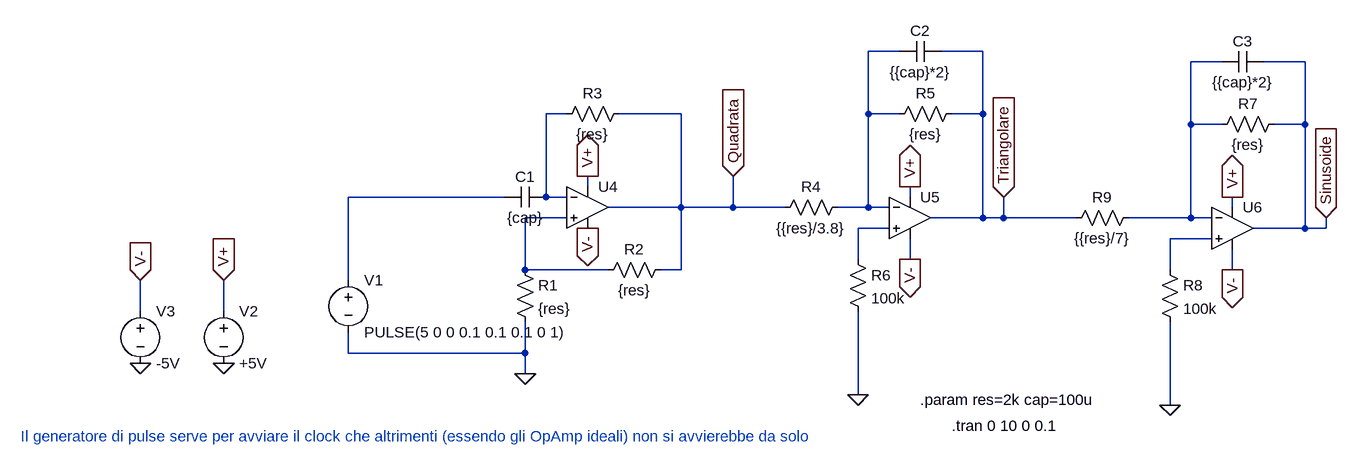
[diagram p0: schematic progetto_PSE_v_Stabile.asc]
progetto_PSE_v_Stabile.asc, the LTspice schematic file:
Version 4
SHEET 1 1248 680
WIRE 416 -144 368 -144
WIRE 544 -144 480 -144
WIRE 912 -128 864 -128
WIRE 1040 -128 976 -128
WIRE -96 -48 -128 -48
WIRE 80 -48 -16 -48
WIRE 368 -48 368 -144
WIRE 416 -48 368 -48
WIRE 544 -48 544 -144
WIRE 544 -48 496 -48
WIRE 864 -32 864 -128
WIRE 912 -32 864 -32
WIRE 1040 -32 1040 -128
WIRE 1040 -32 992 -32
WIRE -64 64 -64 48
WIRE -192 80 -432 80
WIRE -128 80 -128 -48
WIRE -96 80 -128 80
WIRE 432 80 432 64
WIRE 80 96 80 -48
WIRE 80 96 -32 96
WIRE 160 96 160 48
WIRE 160 96 80 96
WIRE 240 96 160 96
WIRE 368 96 368 -48
WIRE 368 96 320 96
WIRE 400 96 368 96
WIRE 928 96 928 80
WIRE -96 112 -160 112
WIRE 544 112 544 -48
WIRE 544 112 464 112
WIRE 576 112 576 80
WIRE 576 112 544 112
WIRE 688 112 576 112
WIRE 864 112 864 -32
WIRE 864 112 768 112
WIRE 896 112 864 112
WIRE 400 128 352 128
WIRE 1040 128 1040 -32
WIRE 1040 128 960 128
WIRE 1072 128 1072 112
WIRE 1072 128 1040 128
WIRE 896 144 832 144
WIRE 352 176 352 128
WIRE 432 176 432 144
WIRE -160 192 -160 112
WIRE -32 192 -160 192
WIRE 80 192 80 96
WIRE 80 192 48 192
WIRE 832 192 832 144
WIRE 928 192 928 160
WIRE -432 208 -432 80
WIRE -752 256 -752 208
WIRE -624 256 -624 208
WIRE -432 320 -432 288
WIRE -160 320 -160 272
WIRE -160 320 -432 320
WIRE -160 352 -160 320
WIRE 352 384 352 256
WIRE 832 400 832 272
FLAG -160 352 0
FLAG 352 384 0
FLAG 432 64 V+
IOPIN 432 64 Out
FLAG -64 48 V+
IOPIN -64 48 Out
FLAG -64 128 V-
IOPIN -64 128 Out
FLAG 432 176 V-
IOPIN 432 176 Out
FLAG 576 80 Triangolare
IOPIN 576 80 In
FLAG 160 48 Quadrata
IOPIN 160 48 In
FLAG 832 400 0
FLAG 928 80 V+
IOPIN 928 80 Out
FLAG 928 192 V-
IOPIN 928 192 Out
FLAG 1072 112 Sinusoide
IOPIN 1072 112 In
FLAG -624 336 0
FLAG -624 208 V+
IOPIN -624 208 In
FLAG -752 336 0
FLAG -752 208 V-
IOPIN -752 208 In
SYMBOL cap -128 64 R90
WINDOW 0 0 32 VBottom 2
WINDOW 3 32 32 VTop 2
SYMATTR InstName C1
SYMATTR Value {cap}
SYMBOL res -176 176 R0
SYMATTR InstName R1
SYMATTR Value {res}
SYMBOL res 64 176 R90
WINDOW 0 0 56 VBottom 2
WINDOW 3 32 56 VTop 2
SYMATTR InstName R2
SYMATTR Value {res}
SYMBOL res 0 -64 R90
WINDOW 0 0 56 VBottom 2
WINDOW 3 32 56 VTop 2
SYMATTR InstName R3
SYMATTR Value {res}
SYMBOL res 336 80 R90
WINDOW 0 0 56 VBottom 2
WINDOW 3 32 56 VTop 2
SYMATTR InstName R4
SYMATTR Value {{res}/3.8}
SYMBOL res 512 -64 R90
WINDOW 0 0 56 VBottom 2
WINDOW 3 32 56 VTop 2
SYMATTR InstName R5
SYMATTR Value {res}
SYMBOL cap 480 -160 R90
WINDOW 0 0 32 VBottom 2
WINDOW 3 32 32 VTop 2
SYMATTR InstName C2
SYMATTR Value {{cap}*2}
SYMBOL res 336 160 R0
SYMATTR InstName R6
SYMATTR Value 100k
SYMBOL res 1008 -48 R90
WINDOW 0 0 56 VBottom 2
WINDOW 3 32 56 VTop 2
SYMATTR InstName R7
SYMATTR Value {res}
SYMBOL cap 976 -144 R90
WINDOW 0 0 32 VBottom 2
WINDOW 3 32 32 VTop 2
SYMATTR InstName C3
SYMATTR Value {{cap}*2}
SYMBOL res 816 176 R0
SYMATTR InstName R8
SYMATTR Value 100k
SYMBOL res 784 96 R90
WINDOW 0 0 56 VBottom 2
WINDOW 3 32 56 VTop 2
SYMATTR InstName R9
SYMATTR Value {{res}/7}
SYMBOL voltage -432 192 R0
WINDOW 123 0 0 Left 0
WINDOW 39 0 0 Left 0
SYMATTR InstName V1
SYMATTR Value PULSE(5 0 0 0.1 0.1 0.1 0 1)
SYMBOL Opamps\\UniversalOpamp2 -64 96 R0
SYMATTR InstName U4
SYMBOL Opamps\\UniversalOpamp2 432 112 R0
SYMATTR InstName U5
SYMBOL Opamps\\UniversalOpamp2 928 128 R0
SYMATTR InstName U6
SYMBOL voltage -624 240 R0
WINDOW 123 0 0 Left 0
WINDOW 39 0 0 Left 0
SYMATTR InstName V2
SYMATTR Value +5V
SYMBOL voltage -752 240 R0
WINDOW 123 0 0 Left 0
WINDOW 39 0 0 Left 0
SYMATTR InstName V3
SYMATTR Value -5V
TEXT 496 432 Left 2 !.tran 0 10 0 0.1
TEXT 448 392 Left 2 !.param res=2k cap=100u
TEXT -936 448 Left 2 ;Il generatore di pulse serve per avviare il clock che altrimenti (essendo gli OpAmp ideali) non si avvierebbe da solo

The netlist it stands for:
* progetto_PSE_v_Stabile.asc
C1 N003 N004 {cap}
R1 N005 0 {res}
R2 Quadrata N005 {res}
R3 Quadrata N003 {res}
R4 N001 Quadrata {{res}/3.8}
R5 Triangolare N001 {res}
C2 Triangolare N001 {{cap}*2}
R6 N006 0 100k
R7 Sinusoide N002 {res}
C3 Sinusoide N002 {{cap}*2}
R8 N007 0 100k
R9 N002 Triangolare {{res}/7}
V1 N004 0 PULSE(5 0 0 0.1 0.1 0.1 0 1)
XU4 N005 N003 V+ V- Quadrata level.2 Avol=1Meg GBW=10Meg Slew=10Meg ilimit=25m rail=0 Vos=0 phimargin=45 en=0 enk=0 in=0 ink=0 Rin=500Meg  ; pins IN+ IN- V+ V- OUT
XU5 N006 N001 V+ V- Triangolare level.2 Avol=1Meg GBW=10Meg Slew=10Meg ilimit=25m rail=0 Vos=0 phimargin=45 en=0 enk=0 in=0 ink=0 Rin=500Meg  ; pins IN+ IN- V+ V- OUT
XU6 N007 N002 V+ V- Sinusoide level.2 Avol=1Meg GBW=10Meg Slew=10Meg ilimit=25m rail=0 Vos=0 phimargin=45 en=0 enk=0 in=0 ink=0 Rin=500Meg  ; pins IN+ IN- V+ V- OUT
V2 V+ 0 +5V
V3 V- 0 -5V
.tran 0 10 0 0.1
.param res=2k cap=100u
* Il generatore di pulse serve per avviare il clock che altrimenti (essendo gli OpAmp ideali) non si avvierebbe da solo
.lib UniversalOpamps2.sub
.backanno
.end